# Altium schematic sheet STeaMi-FP14-Microcontroleur_interface.SchDoc
size A3; DocumentNumber: 1; SheetNumber: 15; SheetTotal: 16
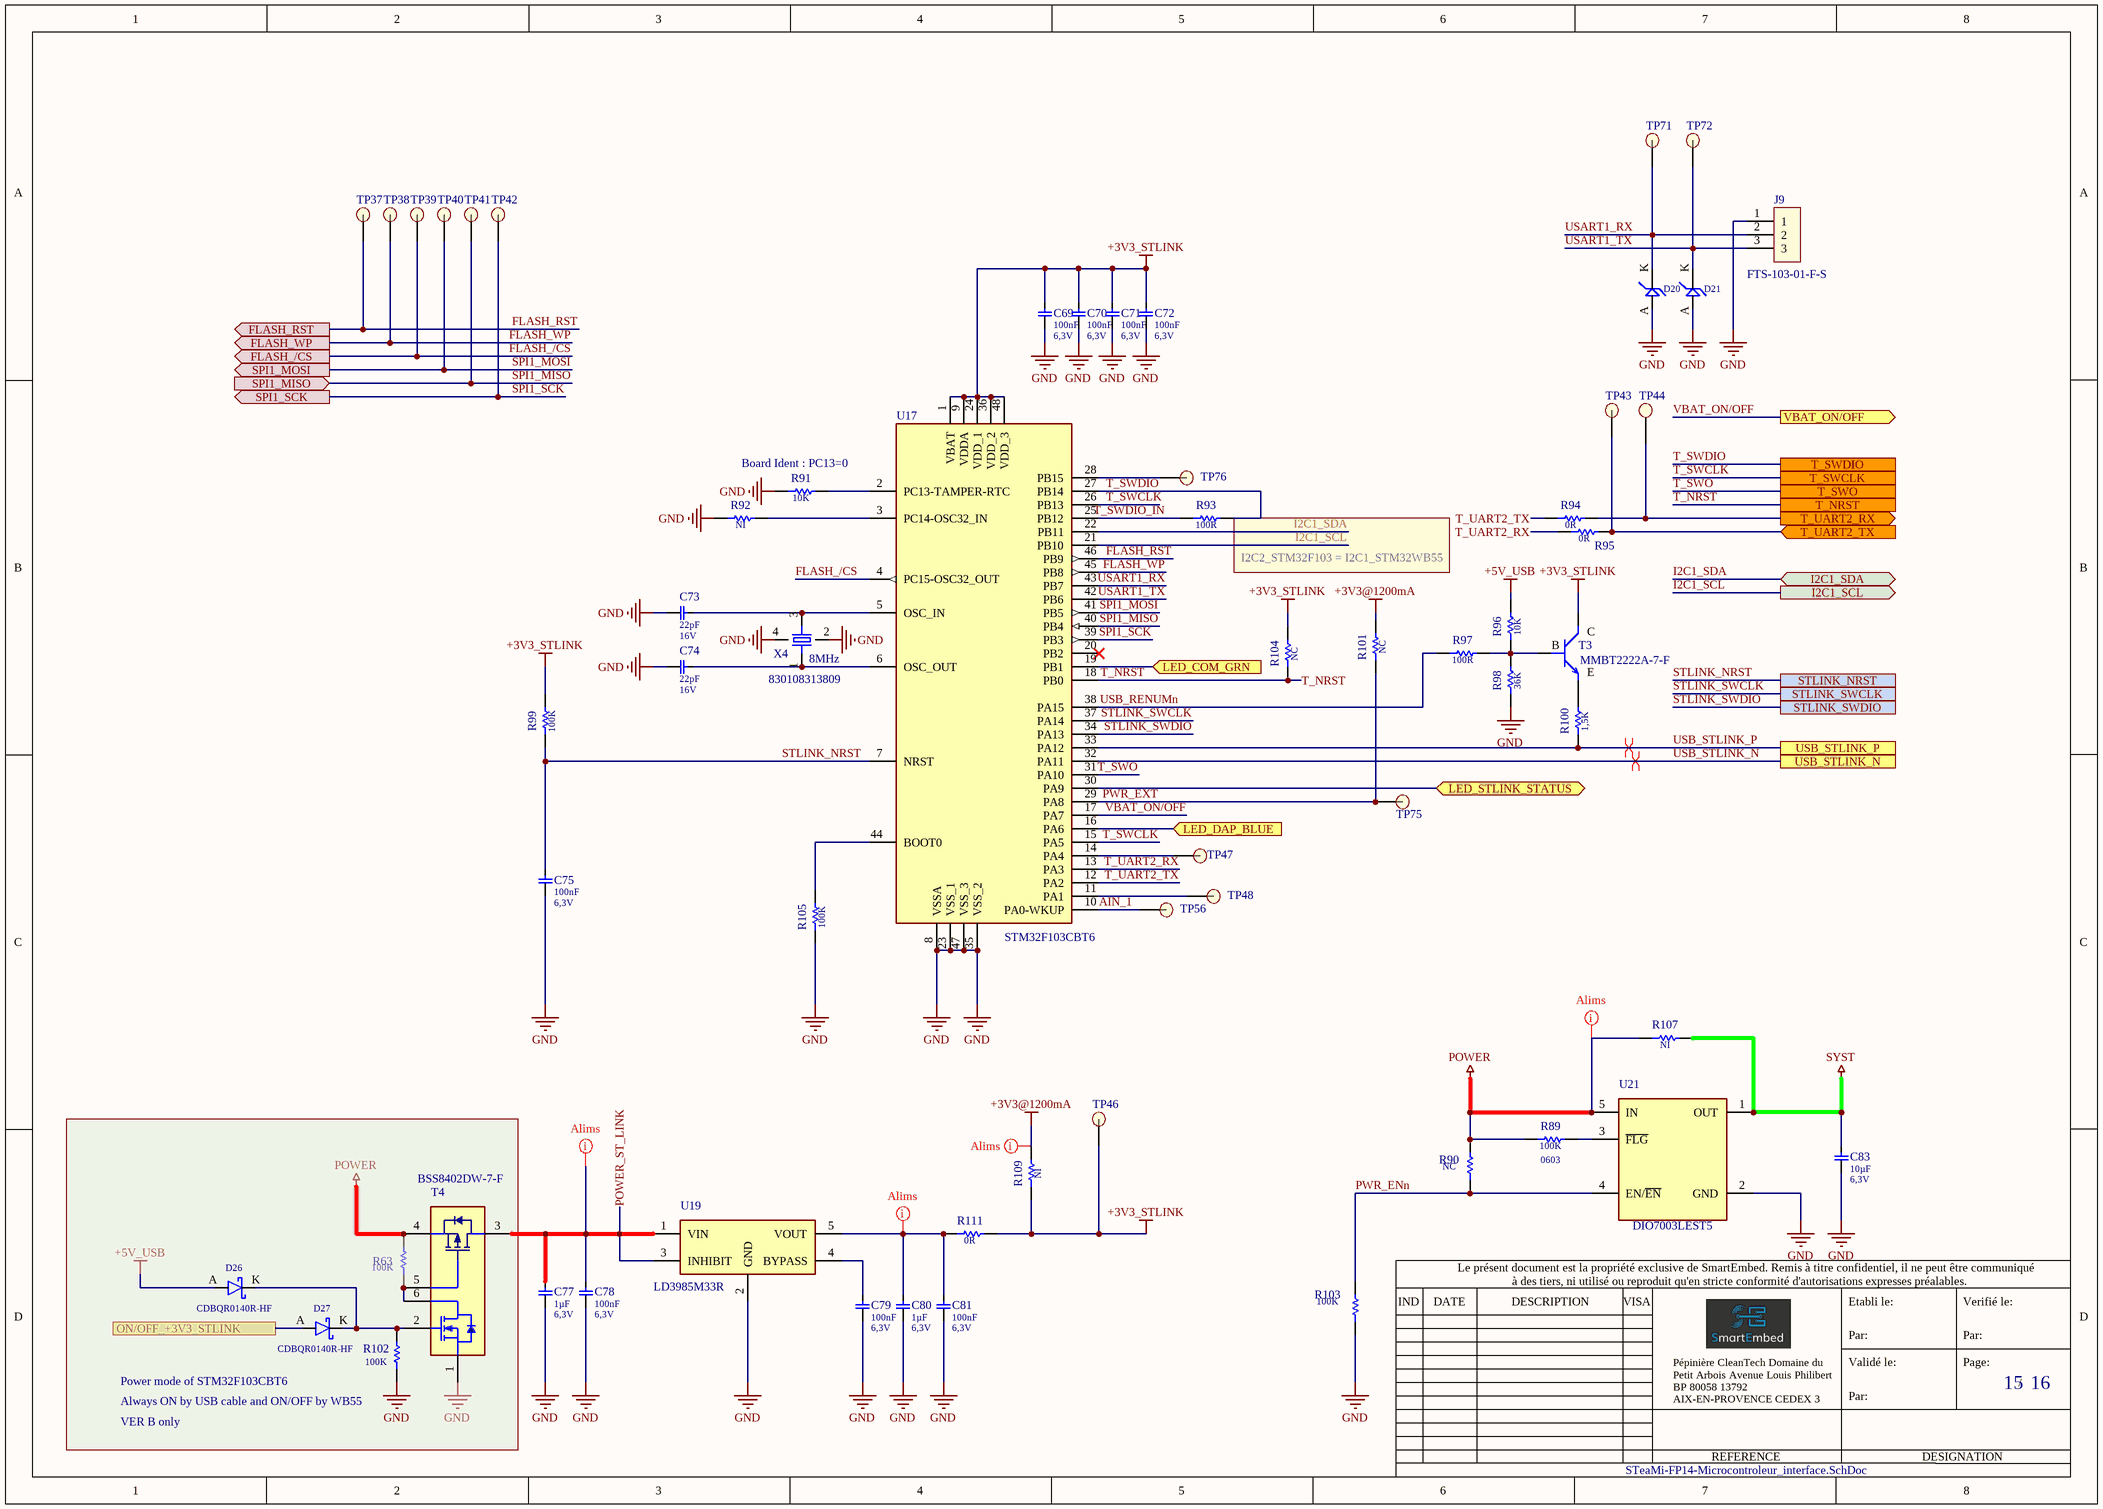
[diagram p0: STeaMi-FP14-Microcontroleur_interface.SchDoc]

## Parts
C69  Capacitance: 100nF  Voltage: 6,3V  [0402-CAP]
C70  Capacitance: 100nF  Voltage: 6,3V  [0402-CAP]
C71  Capacitance: 100nF  Voltage: 6,3V  [0402-CAP]
C72  Capacitance: 100nF  Voltage: 6,3V  [0402-CAP]
C73  Capacitance: 22pF  Voltage: 16V  [0402-CAP]
C74  Capacitance: 22pF  Voltage: 16V  [0402-CAP]
C75  Capacitance: 100nF  Voltage: 6,3V  [0402-CAP]
C77  Capacitance: 1µF  Voltage: 6,3V  [0402-CAP]
C78  Capacitance: 100nF  Voltage: 6,3V  [0402-CAP]
C79  Capacitance: 100nF  Voltage: 6,3V  [0402-CAP]
C80  Capacitance: 1µF  Voltage: 6,3V  [0402-CAP]
C81  Capacitance: 100nF  Voltage: 6,3V  [0402-CAP]
C83  Capacitance: 10µF  Voltage: 6,3V  [0402-CAP]
D20  (no value)  [SODFL1608X70N]
D21  (no value)  [SODFL1608X70N]
D26  Part Number: CDBQR0140R-HF  [CDBQR0140L]
D27  Part Number: CDBQR0140R-HF  [CDBQR0140L]
J9  (no value)  [FTS-103-01-F-S]
R63  Resistance: 100K  [RESC1005X40N_0402]
R89  Resistance: 100K  std Package: 0603  [RESC1608X45N_0603]
R90  Resistance: NC  [RESC1005X40N_0402]
R91  Resistance: 10K  [RESC1005X40N_0402]
R92  (no value)  [RESC1005X40N_0402]
R93  Resistance: 100R  [RESC1005X40N_0402]
R94  Resistance: 0R  [RESC1005X40N_0402]
R95  Resistance: 0R  [RESC1005X40N_0402]
R96  Resistance: 10K  [RESC1005X40N_0402]
R97  Resistance: 100R  [RESC1005X40N_0402]
R98  Resistance: 36K  [RESC1005X40N_0402]
R99  Resistance: 100K  [RESC1005X40N_0402]
R100  Resistance: 1,5K  [RESC1005X40N_0402]
R101  Resistance: NC  [RESC1005X40N_0402]
R102  Resistance: 100K  [RESC1005X40N_0402]
R103  Resistance: 100K  [RESC1005X40N_0402]
R104  Resistance: NC  [RESC1005X40N_0402]  (no BOM)
R105  Resistance: 100K  [RESC1005X40N_0402]
R107  (no value)  [RESC1608X45N_0603]
R109  (no value)  [RESC1005X40N_0402]
R111  Resistance: 0R  [RESC1005X40N_0402]
T3  Manufacturer Part Number: MMBT2222A-7-F  [SOT23-B-C-E]
T4  (no value)  [SOT65P210X110-6N]
TP37  RST  [Testpoint 1mm]  (value not drawn)  (no BOM)
TP38  WP  [Testpoint 1mm]  (value not drawn)  (no BOM)
TP39  /CS  [Testpoint 1mm]  (value not drawn)  (no BOM)
TP40  MOSI  [Testpoint 1mm]  (value not drawn)  (no BOM)
TP41  MISO  [Testpoint 1mm]  (value not drawn)  (no BOM)
TP42  CLK  [Testpoint 1mm]  (value not drawn)  (no BOM)
TP43  T_RX2  [Testpoint 1mm]  (value not drawn)  (no BOM)
TP44  T_TX2  [Testpoint 1mm]  (value not drawn)  (no BOM)
TP46  +3V3  [Testpoint 1mm]  (value not drawn)  (no BOM)
TP47  PAD  [Testpoint 1mm]  (value not drawn)  (no BOM)
TP48  PAD  [Testpoint 1mm]  (value not drawn)  (no BOM)
TP56  PAD  [Testpoint 1mm]  (value not drawn)  (no BOM)
TP71  RX3  [Testpoint 1mm]  (value not drawn)  (no BOM)
TP72  TX3  [Testpoint 1mm]  (value not drawn)  (no BOM)
TP75  PAD  [Testpoint 1mm]  (value not drawn)  (no BOM)
TP76  PAD  [Testpoint 1mm]  (value not drawn)  (no BOM)
U17  (no value)  [QFP50P900X900X160-48N]
U19  (no value)  [SOT95P280X100-5N_SOT-23]
U21  (no value)  [SOT95P280X100-5N SOT23-5]
X4  Part Number: 830108313809  Frequency: 8MHz  [WE_XTAL_CFPX_180]

## Ports
FLASH_/CS (out), FLASH_RST (out), FLASH_WP (out), I2C1_SCL (out), I2C1_SDA (bidir), LED_COM_GRN (in), LED_DAP_BLUE (in), LED_STLINK_STATUS (bidir), ON/OFF_+3V3_STLINK, SPI1_MISO (in), SPI1_MOSI (out), SPI1_SCK (out), STLINK_NRST, STLINK_SWCLK, STLINK_SWDIO, T_NRST, T_SWCLK, T_SWDIO, T_SWO, T_UART2_RX (out), T_UART2_TX (in), USB_STLINK_N, USB_STLINK_P, VBAT_ON/OFF (out)

## Nets
+3V3@1200mA: R101.2 R109.2
+3V3_STLINK: C69.2 C70.2 C71.2 C72.2 R99.2 R104.2 R109.1 R111.2 T3.C(Collector) TP46.1 U17.1(VBAT) U17.9(VDDA) U17.24(VDD_1) U17.36(VDD_2) U17.48(VDD_3)
+5V_USB: D26.A R96.2
GND: C69.1 C70.1 C71.1 C72.1 C73.1 C74.1 C75.1 C77.1 C78.1 C79.1 C80.1 C81.1 C83.1 D20.A D21.A J9.1 R91.1 R92.1 R98.1 R102.1 R103.1 R105.1 T4.1(S1) U17.8(VSSA) U17.23(VSS_1) U17.35(VSS_2) U17.47(VSS_3) U19.2(GND) U21.2(GND) X4.2(GND) X4.4(GND)
POWER: R63.2 R89.1 R90.2 R107.1 T4.4(S2) U21.5(IN)
SYST: C83.2 R107.2 U21.1(OUT)
AIN_1: TP56.1 U17.10(PA0-WKUP)
FLASH_/CS: TP39.1 U17.4(PC15-OSC32_OUT) ; port FLASH_/CS
FLASH_RST: TP37.1 U17.46(PB9) ; port FLASH_RST
FLASH_WP: TP38.1 U17.45(PB8) ; port FLASH_WP
I2C1_SCL: U17.21(PB10) ; port I2C1_SCL
I2C1_SDA: U17.22(PB11) ; port I2C1_SDA
LED_COM_GRN: U17.19(PB1) ; port LED_COM_GRN
LED_DAP_BLUE: U17.16(PA6) ; port LED_DAP_BLUE
LED_STLINK_STATUS: U17.30(PA9) ; port LED_STLINK_STATUS
ON/OFF_+3V3_STLINK: D27.A ; port ON/OFF_+3V3_STLINK
POWER_ST_LINK: C77.2 C78.2 T4.3(D2) U19.1(VIN) U19.3(INHIBIT)
PWR_ENn: R90.1 R103.2 U21.4(EN/~{EN})
PWR_EXT: R101.1 TP75.1 U17.29(PA8)
SPI1_MISO: TP41.1 U17.40(PB4) ; port SPI1_MISO
SPI1_MOSI: TP40.1 U17.41(PB5) ; port SPI1_MOSI
SPI1_SCK: TP42.1 U17.39(PB3) ; port SPI1_SCK
STLINK_NRST: C75.2 R99.1 U17.7(NRST) ; port STLINK_NRST
STLINK_SWCLK: U17.37(PA14) ; port STLINK_SWCLK
STLINK_SWDIO: U17.34(PA13) ; port STLINK_SWDIO
T_NRST: R104.1 U17.18(PB0) ; port T_NRST
T_SWCLK: U17.15(PA5) U17.26(PB13) ; port T_SWCLK
T_SWDIO: R93.2 U17.27(PB14) ; port T_SWDIO
T_SWDIO_IN: R93.1 U17.25(PB12)
T_SWO: U17.31(PA10) ; port T_SWO
T_UART2_RX: R95.1 U17.13(PA3)
T_UART2_RX: R94.2 TP44.1 ; port T_UART2_RX  [a separate net that carries the same name]
T_UART2_TX: R94.1 U17.12(PA2)
T_UART2_TX: R95.2 TP43.1 ; port T_UART2_TX  [a separate net that carries the same name]
USART1_RX: D20.K J9.2 TP71.1 U17.43(PB7)
USART1_TX: D21.K J9.3 TP72.1 U17.42(PB6)
USB_RENUMn: R97.1 U17.38(PA15)
USB_STLINK_N: U17.32(PA11) ; port USB_STLINK_N
USB_STLINK_P: R100.1 U17.33(PA12) ; port USB_STLINK_P
VBAT_ON/OFF: U17.17(PA7) ; port VBAT_ON/OFF
NetC73_2: C73.2 U17.5(OSC_IN) X4.3(IN/OUT)
NetC74_2: C74.2 U17.6(OSC_OUT) X4.1(IN/OUT)
NetC79_2: C79.2 U19.4(BYPASS)
NetC80_2: C80.2 C81.2 R111.1 U19.5(VOUT)
NetD26_K: D26.K D27.K R102.2 T4.2(G1)
NetR63_1: R63.1 T4.5(G2) T4.6(D1)
NetR89_2: R89.2 U21.3(~{FLG})
NetR91_2: R91.2 U17.2(PC13-TAMPER-RTC)
NetR92_2: R92.2 U17.3(PC14-OSC32_IN)
NetR96_1: R96.1 R97.2 R98.2 T3.B(Base)
NetR100_2: R100.2 T3.E(Emitter)
NetR105_2: R105.2 U17.44(BOOT0)
NetTP47_1: TP47.1 U17.14(PA4)
NetTP48_1: TP48.1 U17.11(PA1)
NetTP76_1: TP76.1 U17.28(PB15)

Not connected (* = marked no-connect by the designer): U17 20(PB2)*

## Layout directives
differential pair: USB_STLINK_N, USB_STLINK_P
net class Alims: +3V3@1200mA, NetC80_2, POWER, POWER_ST_LINK

## Notes on the sheet
- Board Ident : PC13=0
- (near R93) I2C2_STM32F103 = I2C1_STM32WB55
- Power mode of STM32F103CBT6
- (near R102) Always ON by USB cable and ON/OFF by WB55
- VER B only
- Le présent document est la propriété exclusive de SmartEmbed. Remis à titre confidentiel, il ne peut être communiqué
- IND
- DATE
- DESCRIPTION
- VISA
- à des tiers, ni utilisé ou reproduit qu'en stricte conformité d'autorisations expresses préalables.
- Etabli le:
- Verifié le:
- Validé le:
- Par:
- Page:
- /
- Pépinière CleanTech Domaine du Petit Arbois Avenue Louis Philibert BP 80058 13792 AIX-EN-PROVENCE CEDEX 3
- REFERENCE
- DESIGNATION

## Library data of the parts
C69-C72 C75 C78 C79 C81 = 100nF-10%-6,3V-X5R-0402: CAP CER 100nF 6,3V X5R 0402; Manufacturer: Kyocera AVX; Manufacturer Part Number: 0402YD104KAT2A; Populated: True; std Package: 0402; Tolerence: 0,1; Vérification: Non; Created by: EAG; Creation Date: 18/10/2021; Checked by: *; Part Number: 100nF-10%-6,3V-X5R-0402; Dielectric: X5R; Digikey: 478-1126-1-ND; Mouser: 581-0402YD104K; Switch possibility: True
C73 = 22pF-5%-16V-COG-0402: CAP CER 22pF 16V COG 0402; Manufacturer 1: KEMET; Manufacturer Part Number 1: C0402C220J4GACAUTO; Populated: True; std Package: 0402; Tolerence: 0,05; Vérification: Non; Created by: EAG; Creation Date: 25/09/2019; Checked by: *; Part Number: 22pF-5%-16V-COG-0402; Dielectric: COG; Digikey: -; Farnell: -; Mouser: 80-C0402C220J4GAUTO; RS: -; Switch possibility: True
C74 = 22pF-5%-16V-COG-0402: CAP CER 22pF 16V COG 0402; Manufacturer: Murata; Manufacturer Part Number: GJM0225C1C220JB01L; Manufacturer 1: KEMET; Manufacturer Part Number 1: C0402C220J4GACAUTO; Populated: True; std Package: 0402; Tolerence: 0,05; Vérification: Non; Created by: EAG; Creation Date: 25/09/2019; Checked by: *; Part Number: 22pF-5%-16V-COG-0402; Dielectric: COG; Digikey: -; Farnell: -; Mouser: 80-C0402C220J4GAUTO; RS: -; Switch possibility: True
C77 C80 = 1µF-10%-6,3V-X5R-0402: CAP CER 1µF 6,3V X5R 0402; Manufacturer: Taiyo Yuden; Manufacturer Part Number: JMK105BJ105KV-F; Populated: True; std Package: 0402; Tolerence: 0,1; Vérification: Non; Created by: EAG; Creation Date: 08/04/2021; Checked by: *; Part Number: 1µF-10%-6,3V-X5R-0402; Dielectric: X5R; Mouser: 963-JMK105BJ105KV-F; Switch possibility: True
C83 = 10µF-20%-6,3V-X5R-0402: CAP CER 10µF 6,3V X5R 0402; Manufacturer: Murata; Manufacturer Part Number: GRM155R60J106ME15D; Populated: True; std Package: 0402; Tolerence: 0,2; Vérification: Non; Created by: EAG; Creation Date: 01/04/2021; Checked by: *; Part Number: 10µF-20%-6,3V-X5R-0402; Dielectric: X5R; Digikey: 490-13238-1-ND; Farnell: -; Mouser: 81-GRM155R60J106ME5D; RS: -; Switch possibility: True
D20 D21 = ESD8351XV2T1G: Suppresseurs ESD / diodes TVS LOW CAP SNAPBACK ESD PROT; Manufacturer: OnSemiconductor; Populated: True; Voltage: 3V3; Switch possibility: False; Vérification: Non; Created by: EAG; Creation Date: 18/12/2021; Manufacturer Part Number: ESD8351XV2T1G; Part Number: ESD8351XV2T1G; Farnell: 2770609; Mouser: 863-ESD8351XV2T1G
D26 D27 = CDBQR0140R-HF: Diode 40 V 100mA Surface Mount 0402C/SOD-923F; Manufacturer: Comchip; Populated: True; Switch possibility: False; Voltage: 40V; Vérification: Non; Created by: EAG; Creation Date: 16/02/2024; Manufacturer Part Number: CDBQR0140R-HF; Digikey: CDBQR0140R-HF-ND
J9 = FTS-103-01-F-S: CONN HEADER VERT 3POS 1.27MM; Manufacturer: SAMTEC; Populated: False; Switch possibility: False; Vérification: Non; Checked by: *; Creation Date: 25/10/2021; Created by: EAG; Manufacturer Part Number: FTS-103-01-F-S; Part Number: FTS-103-01-F-S; Digikey: 612-FTS-103-01-F-S-ND
R63 R102 R103 = 100K-1%-0,1W-0402: RES CMS 100K1%-0,1W-0402 ±100ppm/°C; Manufacturer: Panasonic; Manufacturer Part Number: ERJ-2RKF1003X; Populated: True; Power: 0,1; Nom vérificateur: Non; Prix: 0,085; std Package: 0402; Tolerence: 0,01; Created by: EAG; Creation Date: 08/04/2021; Part Number: 100K-1%-0,1W-0402; Mouser: 667-ERJ-2RKF1003X; Switch possibility: True
R89 = 100K-1%-0,1W-0603: RES CMS 100K1%-0,1W-0603 ±100ppm/°C; Manufacturer: Yageo; Manufacturer Part Number: RC0603FR-07100KL; Populated: True; Power: 0,1; Nom vérificateur: Non; Tolerence: 0,01; Created by: EAG; Creation Date: 24/09/2019; Part Number: 100K-1%-0,1W-0603; Mouser: RC0603FR-07100KL; Switch possibility: True
R90 R101 R104 = NC-0%-0W-0402: RES CMS NI0%-0W-0402 ±100ppm/°C; Populated: True; Power: 0; Nom vérificateur: Non; Prix: 0,1; std Package: 0402; Created by: EAG; Creation Date: 25/11/2022; Manufacturer: NC; Manufacturer Part Number: NC; Part Number: NC-0%-0W-0402; Checked by: -; Digikey: -; Farnell: -; Liste: -; Mouser: -; RS: -; Switch possibility: True; Tolerence: 0
R91 R96 = 10K-1%-0,0625W-0402: RES CMS 10K1%-0,0625W-0402 ±100ppm/°C; Manufacturer: Yageo; Manufacturer Part Number: AC0402FR-1310KL; Populated: True; Power: 0,0625; Nom vérificateur: Non; Prix: 0,088; std Package: 0402; Tolerence: 0,01; Created by: EAG; Creation Date: 08/06/2021; Part Number: 10K-1%-0,0625W-0402; Mouser: 603-AC0402FR-1310KL; Switch possibility: True
R92 R107 R109 = NI-1%-0,1W-0603: NI; Populated: True; Power: 0,1; Nom vérificateur: Non; std Package: 0603; Tolerence: 1%; Created by: MSA; Creation Date: 20/03/2019; Manufacturer: -; Manufacturer Part Number: -; Resistance: NI; Part Number: NI-1%-0,1W-0603; Digikey: -; Farnell: -; Mouser: -; RS: -; Switch possibility: True
R93 R97 = 100R-5%-0,0625W-0402: RES CMS 100R5%-0,0625W-0402 ±100ppm/°C; Manufacturer: Yageo; Manufacturer Part Number: RC0402JR-07100RL; Populated: True; Power: 0,0625; Nom vérificateur: Non; Prix: 0,09; std Package: 0402; Tolerence: 0,05; Created by: EAG; Creation Date: 02/12/2021; Part Number: 100R-5%-0,0625W-0402; Digikey: 311-100JRCT-ND; Farnell: 9232648; Switch possibility: True
R94 R95 R111 = 0R-5%-0,0625W-0402: RES CMS 0R5%-0,0625W-0402; Manufacturer: Yageo; Manufacturer Part Number: RC0402JR-100RL; Populated: True; Power: 0,0625; Nom vérificateur: Non; Prix: 0,09; std Package: 0402; Tolerence: 0,05; Created by: EAG; Creation Date: 02/12/2021; Part Number: 0R-5%-0,0625W-0402; Mouser: 603-RC0402JR-100RL; Switch possibility: True
R98 = 36K-1%-0,0625W-0402: RES CMS 36K1%-0,0625W-0402 ±100ppm/°C; Manufacturer: Yageo; Manufacturer Part Number: RC0402FR-0736KL; Populated: True; Power: 0,0625; Nom vérificateur: Non; Prix: 0,09; std Package: 0402; Tolerence: 0,01; Created by: EAG; Creation Date: 02/12/2021; Part Number: 36K-1%-0,0625W-0402; Digikey: 311-36.0KLRCT-ND; Mouser: 603-RC0402FR-0736KL; Switch possibility: True
R99 R105 = 100K-5%-0,0625W-0402: RES CMS 100K5%-0,0625W-0402 ±100ppm/°C; Manufacturer: Yageo; Manufacturer Part Number: RC0402JR-07100KL; Populated: True; Power: 0,0625; Nom vérificateur: Non; Prix: 0,09; std Package: 0402; Tolerence: 0,05; Created by: EAG; Creation Date: 02/12/2021; Part Number: 100K-5%-0,0625W-0402; Digikey: 311-100KJRCT-ND; Farnell: 9233008; Switch possibility: True
R100 = 1,5K-1%-0,0625W-0402: RES CMS 1,5K1%-0,0625W-0402 ±100ppm/°C; Manufacturer: Yageo; Manufacturer Part Number: RC0402FR-071K5L; Populated: True; Power: 0,0625; Nom vérificateur: Non; Prix: 0,09; std Package: 0402; Tolerence: 0,01; Created by: EAG; Creation Date: 02/12/2021; Part Number: 1,5K-1%-0,0625W-0402; Digikey: 311-1.50KLRDKR-ND; Farnell: 2693583; Mouser: 603-RC0402FR-071K5L; Switch possibility: True
T3 = MMBT2222A: Transistors bipolaires - BJT SS SOT23 NPN 40V; Manufacturer: On Semiconductor; Populated: False; Switch possibility: False; Vérification: Non; Checked by: *; Created by: EAG; Creation Date: 30/09/2021; ComponentLink1Description: Datasheet; ComponentLink1URL: https://assets.nexperia.com/documents/data-sheet/BC847_SER.pdf; Part Number: MMBT2222A; Digikey: MMBT2222A-FDICT-ND; Farnell: 1773626
T4 = BSS8402DW-7-F: MOSFET N/P-CH 60V/50V SOT363; Manufacturer: Diodes Incorporated; Populated: False; Switch possibility: False; Vérification: Non; Created by: EAG; Creation Date: 16/02/2024; Checked by: *; Ambient Temperature: ='Ambient temp'; Storage temperature: ='Storage temp'; Current: *; RoHs compliant: ='Rohs'; Datasheet: ='Datasheet'; Manufacturer Part Number: BSS8402DW-7-F; Part Number: BSS8402DW-7-F; Digikey: BSS8402DW-FDIDKR-ND
TP37-TP44 TP46-TP48 TP56 TP71 TP72 TP76 = TESTPOINTPAD: Manufacturer: Smartembed; Switch possibility: False; Vérification: Non; Package: PAD_TEST; Part Number: TESTPOINTPAD; Created by: EAG; Creation Date: 11/03/2020; Digikey: -; Farnell: -; Manufacturer Part Number: TESTPOINT; Mouser: -; RS: -
TP75 = TESTPOINTPAD: Manufacturer: SmartEmbed; Package: PAD_TEST; Part Number: TESTPOINTPAD
U17 = STM32F103CBT6: ARM® Cortex®-M3 STM32F1 Microcontrôleurs IC 32-Bit 72MHz 128Ko (128K x 8) FLASH; Manufacturer: STMicroelectronics; Populated: False; Switch possibility: False; Vérification: Non; Created by: EAG; Creation Date: 29/09/2021; Checked by: *; Ambient Temperature: ='Ambient temp'; Storage temperature: ='Storage temp'; Current: *; RoHs compliant: ='Rohs'; Datasheet: ='Datasheet'; Manufacturer Part Number: STM32F103CBT6; Part Number: STM32F103CBT6; Digikey: 497-6288-ND; Mouser: 511-STM32F103CBT6
U19 = LD3985M33R: PMIC - Régulateurs de tension - Linéaires Positif Fixe 1 Sortie  150mA SOT-23-5; Manufacturer: STMicroelectronics; Populated: False; Switch possibility: False; Vérification: Non; Created by: EAG; Creation Date: 30/09/2021; Checked by: *; Ambient Temperature: ='Ambient temp'; Storage temperature: ='Storage temp'; Current: *; RoHs compliant: ='Rohs'; Datasheet: ='Datasheet'; Manufacturer Part Number: LD3985M33R; Part Number: LD3985M33R; Digikey: 497-3504-1-ND; Mouser: 6868802P
U21 = DIO7003LEST5: 5,5V Low loss Power distribution switch; Manufacturer: DIOO Microcircuits; Populated: False; Switch possibility: False; Vérification: Non; Created by: EAG; Creation Date: 30/09/2021; Checked by: *; Ambient Temperature: ='Ambient temp'; Storage temperature: ='Storage temp'; Current: *; RoHs compliant: ='Rohs'; Datasheet: ='Datasheet'; Manufacturer Part Number: DIO7003LEST5; Part Number: DIO7003LEST5; Mouser: 453-DIO7003LEST5
X4 = 830108313809: QUARTZ 8MHz 12pF 20 ppm; Manufacturer: Wurth; Populated: True; Switch possibility: False; Vérification: Non; Created by: EAG; Creation Date: 30/09/2021; Manufacturer Part Number: 830108313809; ComponentLink1Description: Datasheet; ComponentLink1URL: https://www.diodes.com/assets/Datasheets/FL.pdf; Digikey: 732-830108313809CT-ND; Mouser: 710-830108313809